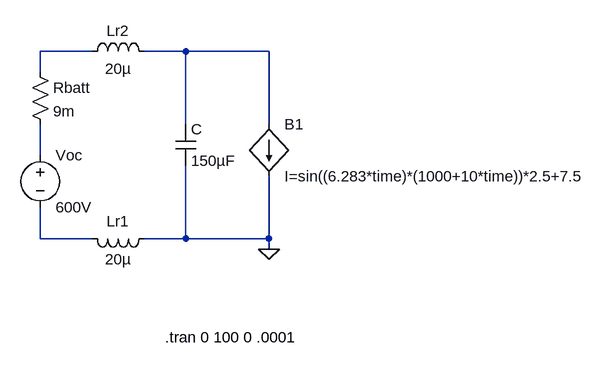
[diagram p0: schematic Circuit Model.asc]
Circuit Model.asc, the LTspice schematic file:
Version 4
SHEET 1 928 680
WIRE 64 -160 -16 -160
WIRE 208 -160 144 -160
WIRE 336 -160 208 -160
WIRE -16 -128 -16 -160
WIRE 208 -48 208 -160
WIRE 336 -48 336 -160
WIRE -16 0 -16 -48
WIRE -16 128 -16 80
WIRE 64 128 -16 128
WIRE 208 128 208 16
WIRE 208 128 144 128
WIRE 336 128 336 32
WIRE 336 128 208 128
WIRE 336 144 336 128
FLAG 336 144 0
SYMBOL voltage -16 -16 R0
SYMATTR InstName Voc
SYMATTR Value 600V
SYMBOL res -32 -144 R0
SYMATTR InstName Rbatt
SYMATTR Value 9m
SYMBOL ind 48 -144 R270
WINDOW 0 32 56 VTop 2
WINDOW 3 5 56 VBottom 2
SYMATTR InstName Lr2
SYMATTR Value 20µ
SYMBOL cap 192 -48 R0
SYMATTR InstName C
SYMATTR Value 150µF
SYMBOL ind 160 112 R90
WINDOW 0 5 56 VBottom 2
WINDOW 3 32 56 VTop 2
SYMATTR InstName Lr1
SYMATTR Value 20µ
SYMBOL bi 336 -48 R0
SYMATTR InstName B1
SYMATTR Value I=sin((6.283*time)*(1000+10*time))*2.5+7.5
TEXT 176 280 Left 2 !.tran 0 100 0 .0001

The netlist it stands for:
* Circuit Model.asc
Voc N003 N004 600V
Rbatt N001 N003 9m
Lr2 N001 N002 20µ
C N002 0 150µF
Lr1 0 N004 20µ
B1 N002 0 I=sin((6.283*time)*(1000+10*time))*2.5+7.5
.tran 0 100 0 .0001
.backanno
.end